# EAGLE schematic WeatherLog (EAGLE 9.5.2)
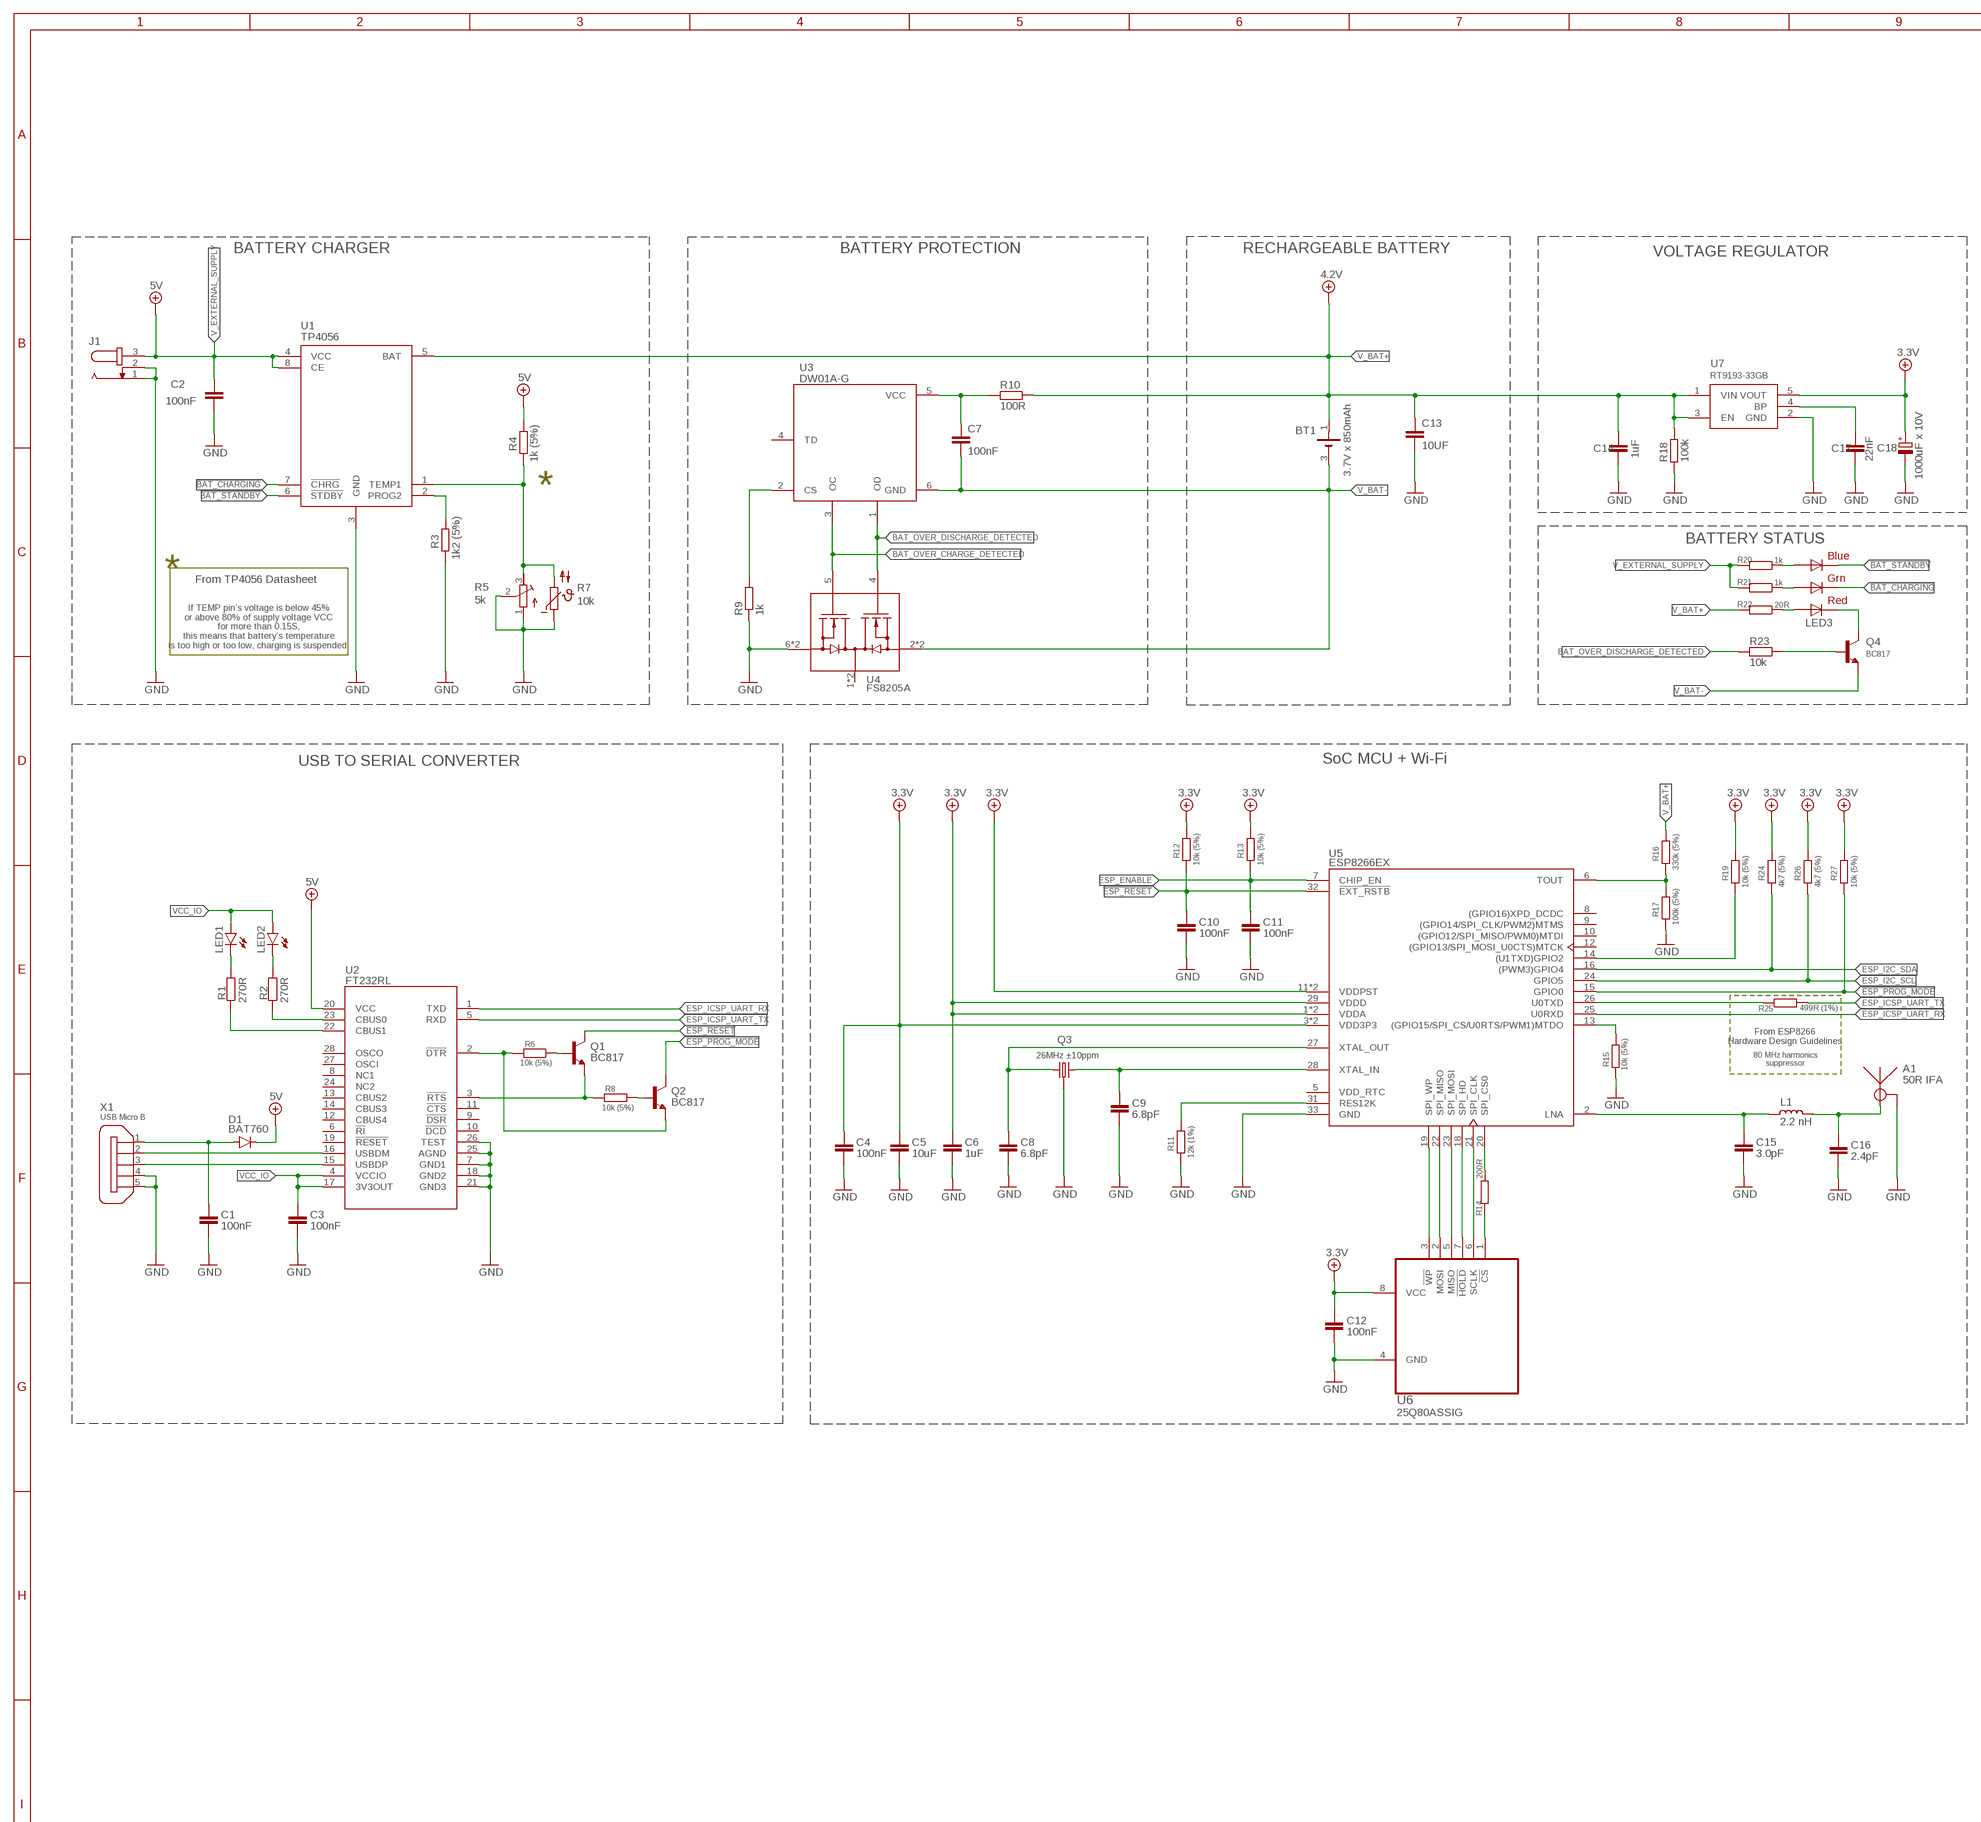
[diagram p0: schematic, sheet 1, part 1 of 2]
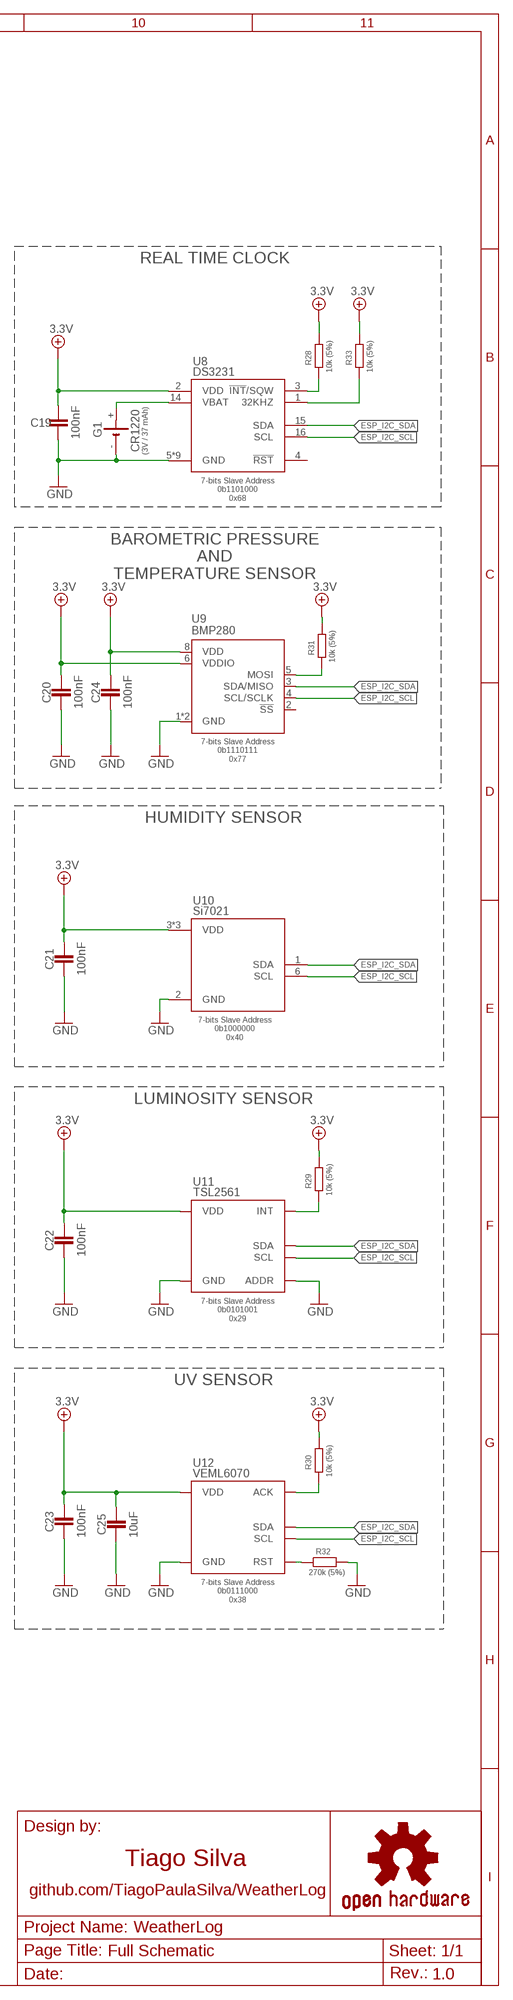
[diagram p1: schematic, sheet 1, part 2 of 2]

## Parts
A1  50R IFA  ANTENNA  [MIFA]
BT1  3.7V x 850mAh  BATTERY-3PIN  [JST-3PIN]
C1  100nF  C-EUC0603  [C0603]
C2  100nF  C-EUC0603  [C0603]
C3  100nF  C-EUC0603  [C0603]
C4  100nF  C-EUC0603  [C0603]
C5  10uF  C-EUC0603  [C0603]
C6  1uF  C-EUC0603  [C0603]
C7  100nF  C-EUC0603  [C0603]
C8  6.8pF  C-EUC0603  [C0603]
C9  6.8pF  C-EUC0603  [C0603]
C10  100nF  C-EUC0603  [C0603]
C11  100nF  C-EUC0603  [C0603]
C12  100nF  C-EUC0603  [C0603]
C13  10UF  C-EUC0603  [C0603]
C14  1uF  C-EUC0805  [C0805]
C15  3.0pF  C-EUC0603  [C0603]
C16  2.4pF  C-EUC0603  [C0603]
C17  22nF  C-EUC0805  [C0805]
C18  1000uF x 10V  CPOL-EUE2-5  [E2-5]
C19  100nF  C-EUC0805  [C0805]
C20  100nF  C-EUC0805  [C0805]
C21  100nF  C-EUC0805  [C0805]
C22  100nF  C-EUC0805  [C0805]
C23  100nF  C-EUC0805  [C0805]
C24  100nF  C-EUC0805  [C0805]
C25  10uF  C-EUC0805  [C0805]
D1  BAT760  DIODE-SOD323-W  [SOD323-W]
G1  CR1220  CH291-1220LF  [CH291-1220LF]
J1  JACK-PLUG0  [SPC4077]
L1  2.2 nH  L_0603  [L0603]
LED1  LED3MM  [LED3MM]
LED2  LED3MM  [LED3MM]
LED3  RGBLED5050  [RGBLED5050]
Q1  BC817  BC817-40LT1SMD  [SOT23-BEC]
Q2  BC817  BC817-40LT1SMD  [SOT23-BEC]
Q3  26MHz ±10ppm  KX-7  [3.2X2.5_KX-7]
Q4  BC817  BC817-40LT1SMD  [SOT23-BEC]
R1  270R  R-EU_0204/7  [0204/7]
R2  270R  R-EU_0204/7  [0204/7]
R3  1k2 (5%)  R-EU_R0603  [R0603]
R4  1k (5%)  R-EU_R0603  [R0603]
R5  5k  R-TRIMM64P  [RTRIM64P]
R6  10k (5%)  R-EU_R0603  [R0603]
R7  10k  NTC640  [P640]
R8  10k (5%)  R-EU_R0603  [R0603]
R9  1k  R-EU_R0603  [R0603]
R10  100R  R-EU_R0603  [R0603]
R11  12k (1%)  R-EU_R0603  [R0603]
R12  10k (5%)  R-EU_R0603  [R0603]
R13  10k (5%)  R-EU_R0603  [R0603]
R14  200R  R-EU_R0603  [R0603]
R15  10k (5%)  R-EU_M0805  [M0805]
R16  330k (5%)  R-EU_R0603  [R0603]
R17  100k (5%)  R-EU_R0603  [R0603]
R18  100k  R-EU_R0603  [R0603]
R19  10k (5%)  R-EU_R0603  [R0603]
R20  1k  R-EU_R0603  [R0603]
R21  1k  R-EU_R0603  [R0603]
R22  20R  R-EU_R0603  [R0603]
R23  10k  R-EU_R0603  [R0603]
R24  4k7 (5%)  R-EU_R0603  [R0603]
R25  499R (1%)  R-EU_R0603  [R0603]
R26  4k7 (5%)  R-EU_R0603  [R0603]
R27  10k (5%)  R-EU_R0603  [R0603]
R28  10k (5%)  R-EU_R0603  [R0603]
R29  10k (5%)  R-EU_R0603  [R0603]
R30  10k (5%)  R-EU_R0603  [R0603]
R31  10k (5%)  R-EU_R0603  [R0603]
R32  270k (5%)  R-EU_R0603  [R0603]
R33  10k (5%)  R-EU_R0603  [R0603]
U1  TP4056  [SOIC127P600X175-9N]
U2  FT232RL  [SSOP28]
U3  DW01A-G  [SOT95P190X145-6N]
U4  FS8205A  [SOP65P640X120-8N]
U5  ESP8266EX  [QFN50P500X500X80-33N]
U6  25Q80ASSIG  [SOP8L_(200MIL)]
U7  RT9193-33GB  [SOT94P279X129-5N]
U8  DS3231/SO  [SO16W]
U9  BMP280  [XDCR_BMP280]
U10  SI7021  [DFN-6P]
U11  TSL2561FN  [DFN-6]
U12  VEML6070  [PHODET_VEML6070]
X1  USB Micro B  ZX62D-B-5PA8  [ZX62D-B-5PA8]

## Nets
3.3V: C4.2 C5.2 C6.2 C12.2 C18.+ C19.2 C20.2 C21.2 C22.2 C23.2 C24.2 C25.2 R12.2 R13.2 R19.2 R24.2 R26.2 R27.2 R28.2 R29.2 R30.2 R31.2 R33.2 U5.1(VDDA) U5.3(VDD3P3) U5.4(VDD3P3) U5.11(VDDPST) U5.17(VDDPST) U5.29(VDDD) U5.30(VDDA) U6.8(VCC) U7.5(VOUT) U8.2(VDD) U9.6(VDDIO) U9.8(VDD) U10.3(VDD) U10.4(VDD) U10.5(VDD) U11.VDD U12.6(VDD)
!BAT_CHARGING!: LED3.6(GREEN_C) U1.7(!CHRG)
!BAT_STANDBY!: LED3.4(BLUE_C) U1.6(!STDBY)
!ESP_PROG_MODE!: Q2.C R27.1 U5.15(GPIO0)
!ESP_RESET!: C10.2 Q1.C R12.1 U5.32(!EXT_RSTB)
BAT_OVER_CHARGE_DETECTED: U3.3(OC) U4.5(G2)
BAT_OVER_DISCHARGE_DETECTED: R23.2 U3.1(OD) U4.4(G1)
DTR: Q2.E R6.2 U2.2(!DTR!)
ESP_ENABLE: C11.2 R13.1 U5.7(CHIP_EN)
ESP_I2C_SCL: R26.1 U5.24(GPIO5) U8.16(SCL) U9.4(SCL/SCLK) U10.6(SCL) U11.SCL U12.5(SCL)
ESP_I2C_SDA: R24.1 U5.16((PWM3)GPIO4) U8.15(SDA) U9.3(SDA/MISO) U10.1(SDA) U11.SDA U12.3(SDA)
ESP_ICSP_UART_RX: U2.1(TXD) U5.25(U0RXD)
ESP_ICSP_UART_TX: R25.2 U2.5(RXD)
GND [gnd]: A1.GND C1.1 C2.2 C3.1 C4.1 C5.1 C6.1 C8.1 C9.1 C10.1 C11.1 C12.1 C13.2 C14.2 C15.1 C16.1 C17.2 C18.- C19.1 C20.1 C21.1 C22.1 C23.1 C24.1 C25.1 G1.- J1.1 J1.2 Q3.2(GND) Q3.4(GND) R3.1 R5.1(A) R5.2(S) R7.1 R9.1 R11.1 R15.2 R17.1 R18.1 R32.2 U1.3(GND) U2.7(GND1) U2.18(GND2) U2.21(GND3) U2.25(AGND) U2.26(TEST) U4.6(S2_1) U4.7(S2_1) U5.33(GND) U6.4(GND) U7.2(GND) U8.5(GND) U8.6(GND) U8.7(GND) U8.8(GND) U8.9(GND) U8.10(GND) U8.11(GND) U8.12(GND) U8.13(GND) U9.1(GND) U9.7(GND) U10.2(GND) U11.ADDR U11.GND U12.1(GND) X1.4 X1.5
N$1: Q4.B R23.1
N$2: R14.2 U5.20(SPI_CS0)
N$3: LED3.5(RED_C) Q4.C
N$4: C17.1 U7.4(BP)
N$5: LED3.2(RED_A) R22.1
N$6: R3.2 U1.2(PROG2)
N$7: R9.2 U3.2(CS)
N$8: C7.1 R10.2 U3.5(VCC)
N$9: G1.+ U8.14(VBAT)
N$10: LED3.1(GREEN_A) R21.1
N$11: C8.2 Q3.1 U5.27(XTAL_OUT)
N$12: LED3.3(BLUE_A) R20.1
N$13: R14.1 U6.1(!CS!)
N$14: U5.21(SPI_CLK) U6.6(SCLK)
N$15: U5.18(SPI_HD) U6.7(!HOLD!)
N$16: R4.1 R5.3(E) R7.2 U1.1(TEMP1)
N$17: R2.1 U2.23(CBUS0)
N$18: R16.1 R17.2 U5.6(TOUT)
N$19: R1.1 U2.22(CBUS1)
N$20: Q2.B R8.2
N$21: U5.23(SPI_MOSI) U6.5(MISO)
N$23: U5.22(SPI_MISO) U6.2(MOSI)
N$24: C15.2 L1.2 U5.2(LNA)
N$25: R11.2 U5.31(RES12K)
N$26: U5.19(SPI_WP) U6.3(!WP!)
N$27: C9.2 Q3.3 U5.28(XTAL_IN)
N$28: R25.1 U5.26(U0TXD)
N$29: A1.FEED C16.2 L1.1
N$30: R28.1 U8.3(!INT!/SQW)
N$31: R15.1 U5.13((GPIO15/SPI_CS/U0RTS/PWM1)MTDO)
N$32: R33.1 U8.1(32KHZ)
N$33: R29.1 U11.INT
N$34: R31.1 U9.5(MOSI)
N$35: R30.1 U12.2(ACK)
N$36: R32.1 U12.4(RST)
N$37: R19.1 U5.14((U1TXD)GPIO2)
N$49: LED2.K(C) R2.2
N$50: LED1.K(C) R1.2
N$53: U2.16(USBDM) X1.2
N$54: U2.15(USBDP) X1.3
N$59: Q1.B R6.1
RTS: Q1.E R8.1 U2.3(!RTS!)
V_BAT+: BT1.1(+) C13.1 C14.1 R10.1 R16.2 R18.2 R22.2 U1.5(BAT) U7.1(VIN) U7.3(EN) ; supply symbol labelled 4.2V
V_BAT-: BT1.3(-) C7.2 Q4.E U3.6(GND) U4.2(S1_1) U4.3(S1_1)
V_EXTERNAL_SUPPLY: C2.1 D1.C J1.3 R4.2 R20.2 R21.2 U1.4(VCC) U1.8(CE) U2.20(VCC) ; supply symbol labelled 5V
VCC_IO: C3.2 LED1.A LED2.A U2.4(VCCIO) U2.17(3V3OUT)
VUSB1: C1.2 D1.A X1.1
Unconnected: U2.6(!RI!) U2.8(NC1) U2.9(!DSR!) U2.10(!DCD!) U2.11(!CTS!) U2.12(CBUS4) U2.13(CBUS2) U2.14(CBUS3) U2.19(!RESET!) U2.24(NC2) U2.27(OSCI) U2.28(OSCO) U3.4(TD) U4.1(D12_1) U4.8(D12_1) U5.5(VDD_RTC) U5.8((GPIO16)XPD_DCDC) U5.9((GPIO14/SPI_CLK/PWM2)MTMS) U5.10((GPIO12/SPI_MISO/PWM0)MTDI) U5.12((GPIO13/SPI_MOSI_U0CTS)MTCK) U8.4(!RST!) U9.2(!SS!) X1.S1 X1.S2 X1.S3 X1.S4

## Notes on the sheet
- BATTERY CHARGER | BATTERY PROTECTION | RECHARGEABLE BATTERY | VOLTAGE REGULATOR | REAL TIME CLOCK
- (3V / 37 mAh)
- 7-bits Slave Address
  0b1101000
  0x68
- *
- BAROMETRIC PRESSURE
  AND
  TEMPERATURE SENSOR
- BATTERY STATUS
- *
- From TP4056 Datasheet
- If TEMP pin’s voltage is below 45%
  or above 80% of supply voltage VCC
  for more than 0.15S,
  this means that battery’s temperature
  is too high or too low, charging is suspended.
- 7-bits Slave Address
  0b1110111
  0x77
- USB TO SERIAL CONVERTER | SoC MCU + Wi-Fi
- HUMIDITY SENSOR
- 7-bits Slave Address
  0b1000000
  0x40
- From ESP8266
  Hardware Design Guidelines
- LUMINOSITY SENSOR
- 80 MHz harmonics
  suppressor
- 7-bits Slave Address
  0b0101001
  0x29
- UV SENSOR
- 7-bits Slave Address
  0b0111000
  0x38
- Tiago Silva
- github.com/TiagoPaulaSilva/WeatherLog
- Full Schematic
- 1.0

## Library data of the parts
A1 = PCB Antenna:ANTENNA: This is a PCB Inverted F Antenna (IFA). This IFA was designed to match an impedance of 50 ohms at 2.45 GHz.
BT1 = Battery-Cable:BATTERY-3PIN
C1-C17 C19-C25 = rcl:C-EU: CAPACITOR, European symbol; SPICEPREFIX: C
C18 = rcl:CPOL-EU: POLARIZED CAPACITOR, European symbol; SPICEPREFIX: C
D1 = diode:DIODE-: DIODE
G1 = battery:CH291-1220LF: Battery Holder, SMT, 12mm multicomp PART NO. CH291-1220LF Source: Data sheet <http://www.farnell.com/datasheets/1505860.pdf>
J1 = con-jack:JACK-PLUG: DC POWER JACK Power Jack, DC, Right Angle, Through Hole, Rated 5A at 16VDC, PC Terminals Distributor: Farnell (www.Farnell.de) Drawing: 84N1161.pdf / 84N1162.pdf Manufacturer: SPC Technology (www.spctechnology.com) Type: SPC4077 / SPC 4078; OC_FARNELL: unknown; OC_NEWARK: unknown
L1 = rc-master-smd:L_: INDUCTOR
LED1 LED2 = led:LED: LED OSRAM: - CHIPLED LG R971, LG N971, LY N971, LG Q971, LY Q971, LO R971, LY R971 LH N974, LH R974 LS Q976, LO Q976, LY Q976 LO Q996 - Hyper CHIPLED LW Q18S LB Q993, LB Q99A, LB R99A - SideLED LS A670, LO A670, LY A670, LG A670, LP A670 LB A673, LV A673, LT A673, LW A673 LH A674 LY A675 LS A676, LA A676, LO A676, LY A676, LW A676 LS A679, LY A679, LG A679 - Hyper Micro SIDELED® LS Y876, LA Y876, LO Y876, LY Y876 LT Y87S - SmartLED LW L88C, LW L88S LB L89C, LB L89S, LG L890 LS L89K, LO L89K, LY L89K LS L896, LA L896, LO L896, LY L896 - TOPLED LS T670, LO T670, LY T670, LG T670, LP T670 LSG T670, LSP T670, LSY T670, LOP T670, LYG T670 LG T671, LOG T671, LSG T671 LB T673, LV T673, LT T673, LW T673 LH T674 LS T676, LA T676, LO T676, LY T676, LB T676, LH T676, LSB T676, LW T676 LB T67C, LV T67C, LT T67C, LS T67K, LO T67K, LY T67K, LW E67C LS E67B, LA E67B, LO E67B, LY E67B, LB E67C, LV E67C, LT E67C LW T67C LS T679, LY T679, LG T679 LS T770, LO T770, LY T770, LG T770, LP T770 LB T773, LV T773, LT T773, LW T773 LH T774 LS E675, LA E675, LY E675, LS T675 LS T776, LA T776, LO T776, LY T776, LB T776 LHGB T686 LT T68C, LB T68C - Hyper Mini TOPLED® LB M676 - Mini TOPLED Santana® LG M470 LS M47K, LO M47K, LY M47K Source: http://www.osram.convergy.de LUXEON: - LUMILED® LXK2-PW12-R00, LXK2-PW12-S00, LXK2-PW14-U00, LXK2-PW14-V00 LXK2-PM12-R00, LXK2-PM12-S00, LXK2-PM14-U00 LXK2-PE12-Q00, LXK2-PE12-R00, LXK2-PE12-S00, LXK2-PE14-T00, LXK2-PE14-U00 LXK2-PB12-K00, LXK2-PB12-L00, LXK2-PB12-M00, LXK2-PB14-N00, LXK2-PB14-P00, LXK2-PB14-Q00 LXK2-PR12-L00, LXK2-PR12-M00, LXK2-PR14-Q00, LXK2-PR14-R00 LXK2-PD12-Q00, LXK2-PD12-R00, LXK2-PD12-S00 LXK2-PH12-R00, LXK2-PH12-S00 LXK2-PL12-P00, LXK2-PL12-Q00, LXK2-PL12-R00 Source: www.luxeon.com KINGBRIGHT: KA-3528ASYC Source: www.kingbright.com
LED3 = adafruit:RGBLED: For 5050 RGB LEDs, the order of the LEDs may vary from one manufacturer to another!
Q1 Q2 Q4 = transistor-npn:BC817*: NPN Transistor
Q3 = Crystal (SMD):KX: Quartz Crystals (MHz) SMD: KX - Serie Model Size l/w/h [mm] Frequency Range Frequency Stability Temp. Range [°C] Load Capacitance AECQ 200 availabel Datasheet KX-4 KX-5 KX-6 KX-7 KX-9A KX-9B KX-12A KX-12B KX-13 KX-20 KX-K KX-KS 1.6/1.2/0.3 2.0/1.6/0.45 2.5/2.0/0.55 3.2/2.5/0.8 5.0/3.2/1.0 5.0/3.2/1.1 6.0/3.5/1.1 6.0/3.5/1.0 7.0/5.0 /1.3 11.6/5.5/1.6 12.3/4.5/4.2 12.3/4.5/3.2 24.0 ~ 80.0 MHz 16.0 ~ 80.0 MHz 12.0 ~ 80.0 MHz 8.0 ~ 60.0 MHz 7,68 ~ 300,0 MHz 8,0 ~ 50,0 MHz 8,0 ~ 150,0 MHz 8,0 ~ 50,0 MHz 6,0 ~ 160,0 MHz 3,579 ~ 25,0 MHz 3,579 ~ 70,0 MHz 3,579 ~ 70,0 MHz ±10 … ±50ppm ±10 … ±50ppm ±10 … ±50ppm ±10 … ±50ppm ±10 … ±50ppm ±10 … ±50ppm ±10 … ±50ppm ±10 … ±50ppm ±10 … ±50ppm ±50ppm ±10 … ±50ppm ±10 … ±50ppm (*) -40°C …+85°C (*) -40°C …+125°C (*) -40°C …+125°C (*) -40°C …+125°C (*) -40°C …+105°C (*) -40°C …+105°C (*) -40°C …+125°C (*) -40°C …+105°C (*) -40°C …+105°C (*) -40°C …+105°C (*) -40°C …+85°C (*) -40°C …+85°C 8, 8…16 8, 8…16 10, 8…16 12, 7…20 16, 10…20 16, 10…20 16, 10…20 16, 12…20 16, 12…20 16, 12…20 16, 12…30 16, 12…30 - yes yes yes - - - - - - - - KX-4.pdf <http://www.geyer-electronic.de/uploads/tx_userartikelfrequenz/GEYER-KX-4.pdf> KX-5.pdf <http://www.geyer-electronic.de/uploads/tx_userartikelfrequenz/GEYER-KX-5.pdf> KX-6.pdf <http://www.geyer-electronic.de/uploads/tx_userartikelfrequenz/GEYER-KX-6.pdf> KX-7.pdf <http://www.geyer-electronic.de/uploads/tx_userartikelfrequenz/GEYER-KX-7.pdf> KX-9A.pdf <http://www.geyer-electronic.de/uploads/tx_userartikelfrequenz/GEYER-KX-9A.pdf> KX-9B.pdf <http://www.geyer-electronic.de/uploads/tx_userartikelfrequenz/GEYER-KX-9B.pdf> KX-12A.pdf <http://www.geyer-electronic.de/uploads/tx_userartikelfrequenz/GEYER-KX-12A.pdf> KX-12B.pdf <http://www.geyer-electronic.de/uploads/tx_userartikelfrequenz/GEYER-KX-12B.pdf> KX-13.pdf <http://www.geyer-electronic.de/uploads/tx_userartikelfrequenz/GEYER-KX-13.pdf> KX-20.pdf <http://www.geyer-electronic.de/uploads/tx_userartikelfrequenz/GEYER-KX-20.pdf> KX-K.pdf <http://www.geyer-electronic.de/uploads/tx_userartikelfrequenz/GEYER-KX-K.pdf> KX-KS.pdf <http://www.geyer-electronic.de/uploads/tx_userartikelfrequenz/GEYER-KX-KS.pdf> <http://www.geyer-electronic.de/fileadmin/template/img/logo-geyer-electronic.png> Details see: http://www.geyer-electronic.de/Frequenz-Produkte.9.0.html Created 2016-06-07, Hans Locher 2016 (C) Geyer Quartz Technology KX4,KX5,KX6,KX7,KX9A,KX9B,KX12A,KX12B,KX13,KX20,KXK,KXKS;1612;2016;2520;3225;5032;6035;7050;11655;12345;1,6x1,2;2,0x1,6;2,5x2,0;3,2x2,5;5,0x3,2;6,0x3,5;7,0x5,0;11,6x5,5;12,3x4,5;12,3x4,5;1.6x1.2;2.0x1.6;2.5x2.0;3.2x2.5;5.0x3.2;6.0x3.5;7.0x5.0;11.6x5.5;12.3x4.5;12.3x4.5;
R1 R2 = rcl:R-EU_: RESISTOR, European symbol
R3 R4 R6 R8-R33 = rcl:R-EU_: RESISTOR, European symbol; SPICEPREFIX: R
R5 = resistor:R-TRIMM: Trimm resistor
R7 = ptc-ntc:NTC640: PHILIPS NTC; OC_FARNELL: unknown; OC_NEWARK: unknown
U1 = TP4056:TP4056: 1A Standalone Linear Li-lon Battery Charger, SOP-8 Source: Datasheet <https://dlnmh9ip6v2uc.cloudfront.net/datasheets/Prototyping/TP4056.pdf>; DESCRIPTION: 1A Standalone Linear Li-lon Battery Charger, SOP-8; HEIGHT: 1.75mm; MANUFACTURER_NAME: NanJing Top Power; MANUFACTURER_PART_NUMBER: TP4056
U2 = FT232RL:FT232RL
U3 = DW01A-G:DW01A-G: one cell lithium-ion/polymer battery protection IC Source: Datasheet <http://www.ic-fortune.com/upload/Download/DW01x-DS-17_EN.pdf>; DESCRIPTION: one cell lithium-ion/polymer battery protection IC; HEIGHT: 1.45mm; MANUFACTURER_NAME: SII Semiconductor; MANUFACTURER_PART_NUMBER: DW01A-G
U4 = FS8205A:FS8205A: dual n-channel enhancement mode power MOFSET Source: Datasheet <http://www.ic-fortune.com/upload/Download/FS8205A-DS-12_EN.pdf>; DESCRIPTION: dual n-channel enhancement mode power MOFSET; HEIGHT: 1.2mm; MANUFACTURER_NAME: SII Semiconductor; MANUFACTURER_PART_NUMBER: FS8205A
U5 = ESP8266EX:ESP8266EX: ESP8266EX, Highly Integrated Wi-Fi SoC. 32- VQFN, 5x5mm; AVAILABILITY: Unavailable; DESCRIPTION: IC RF TxRx + MCU WiFi 802.11b/g/n 2.4GHz 32-VFQFN Exposed Pad; MF: Espressif Systems; MP: ESP8266EX; PACKAGE: VFQFN-32 Espressif Systems; PRICE: None
U6 = 25Q80ASSIG:25Q80ASSIG: 16-megabit Minimum SPI Serial Flash Memory; AVAILABILITY: Unavailable; DESCRIPTION: FLASH Memory IC 16Mb _2M x 8_ SPI 100MHz 8-SOIC; MF: Adesto Technologies; MP: AT25DF161-SH-B; PACKAGE: SO-8 Microchip; PRICE: None
U7 = RT9193-33GB:RT9193-33GB: RT9193 Series 300 mA 3.3 V Ultra-Low Noise Ultra-Fast CMOS LDO Regulator-SC-70-5; AVAILABILITY: Unavailable; DESCRIPTION: Linear Voltage Regulator IC 1 Output 300mA SOT-23-5; MF: Richtek USA; MP: RT9193-33GB; PACKAGE: SOT-23-5 Richtek; PRICE: None
U8 = adafruit:DS3231
U9 = BMP280:BMP280: BMP280 Absolute Barometric Pressure Sensor for Battery Powered Devices 2 x 2.5mm; AVAILABILITY: Unavailable; DESCRIPTION: Pressure Sensor 4.35PSI ~ 15.95PSI _30kPa ~ 110kPa_ Absolute 16b 8-SMD; MF: Bosch; MP: BMP280; PACKAGE: SMD-8 Bosch Sensortec; PRICE: None
U10 = SI7021:SI7021
U11 = TSL2561:TSL2561; AVAILABILITY: Unavailable; DESCRIPTION: Optical Sensor Ambient 640nm I²C 6-SMD, No Lead; MF: ams; MP: TSL2561; PACKAGE: SMD-6 ams; PRICE: None
U12 = VEML6070:VEML6070: VEML6070 UV A Light Sensor with I2C Interface: VEML6070 is an advanced ultraviolet (UV) light sensor with I2C protocol interface and designed by the CMOS process. It is easily operated via a simple I2C command. The active acknowledge (ACK) feature with threshold windows setting allows the UV sensor to send out a UVI alert message. Under a strong solar UVI condition, the smart ACK signal can be easily implemented by the software programming. Device Model created 15.06.2016 by Johannes Kolb - Vishay Semiconductor GmbH; AVAILABILITY: Unavailable; DESCRIPTION: Optical Sensor Ultraviolet _UV_ 335nm I²C 6-SMD Module; MF: Vishay; MP: VEML6070; PACKAGE: SMD-6 Vishay; PRICE: None
X1 = Micro USB Connector:ZX62D-B-5PA8: Micro USB Type B Connector - Standard, Shell Through Hole Source: http://www.hirose.co.jp/cataloge_hp/ed_ZX_20140804.pdf; MF: Hirose; MPN: ZX62D-B-5PA8; OC_FARNELL: 2300438; OC_NEWARK: 69W0712

## Net classes
2 gnd: width 0.305 mm, drill 0.559 mm, clearance 0.254 mm